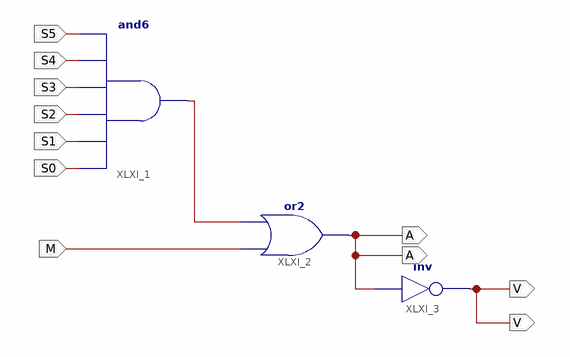
[diagram p0: schematic sheet 1]
// Xilinx ISE schematic C3_27.sch (kintex7) as structural Verilog: 3 symbols, 9 ports
module C3_27 (
  input  S0,
  input  S1,
  input  S2,
  input  S3,
  input  S4,
  input  S5,
  input  M,
  output A,
  output V
);

  wire XLXN_7;

  and XLXI_1 (XLXN_7, S0, S1, S2, S3, S4, S5);
  or XLXI_2 (A, M, XLXN_7);
  not XLXI_3 (V, A);
endmodule
